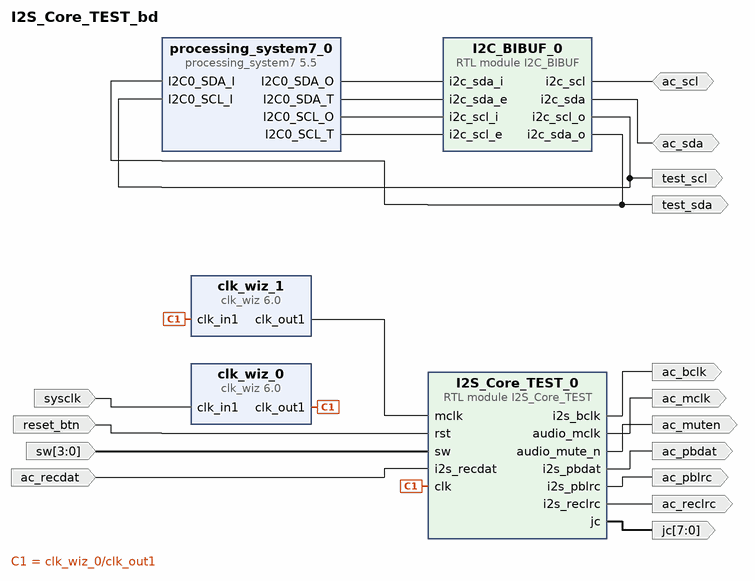
[diagram p0: block diagram of the top level]
# Vivado block design I2S_Core_TEST_bd, xc7z010clg400-1, Vivado 2020.1
create_bd_design I2S_Core_TEST_bd

create_bd_port -dir O -type clk ac_bclk
create_bd_port -dir O -type clk ac_mclk
create_bd_port -dir O ac_muten
create_bd_port -dir O ac_pbdat
create_bd_port -dir O ac_pblrc
create_bd_port -dir O ac_reclrc
create_bd_port -dir I -type rst reset_btn
set_property -dict {CONFIG.POLARITY ACTIVE_HIGH} [get_bd_ports reset_btn]
create_bd_port -dir O -from 7 -to 0 jc
create_bd_port -dir I -from 3 -to 0 sw
create_bd_port -dir IO ac_sda
create_bd_port -dir IO ac_scl
create_bd_port -dir I -type clk sysclk
set_property -dict {CONFIG.FREQ_HZ 125000000} [get_bd_ports sysclk]
create_bd_port -dir O test_scl
create_bd_port -dir O test_sda
create_bd_port -dir I ac_recdat

create_bd_cell -type ip -vlnv xilinx.com:ip:clk_wiz:6.0 clk_wiz_0
set_property -dict [list \
  CONFIG.CLKOUT1_DRIVES BUFG \
  CONFIG.CLKOUT1_JITTER 237.312 \
  CONFIG.CLKOUT1_PHASE_ERROR 249.865 \
  CONFIG.CLKOUT2_DRIVES BUFG \
  CONFIG.CLKOUT3_DRIVES BUFG \
  CONFIG.CLKOUT4_DRIVES BUFG \
  CONFIG.CLKOUT5_DRIVES BUFG \
  CONFIG.CLKOUT6_DRIVES BUFG \
  CONFIG.CLKOUT7_DRIVES BUFG \
  CONFIG.MMCM_BANDWIDTH OPTIMIZED \
  CONFIG.MMCM_CLKFBOUT_MULT_F 36 \
  CONFIG.MMCM_CLKOUT0_DIVIDE_F 9 \
  CONFIG.MMCM_COMPENSATION ZHOLD \
  CONFIG.PRIMITIVE PLL \
] [get_bd_cells clk_wiz_0]
create_bd_cell -type ip -vlnv xilinx.com:ip:clk_wiz:6.0 clk_wiz_1
set_property -dict [list \
  CONFIG.CLKOUT1_JITTER 360.948 \
  CONFIG.CLKOUT1_PHASE_ERROR 301.601 \
  CONFIG.CLKOUT1_REQUESTED_OUT_FREQ 12.288 \
  CONFIG.MMCM_CLKFBOUT_MULT_F 48.000 \
  CONFIG.MMCM_CLKOUT0_DIVIDE_F 78.125 \
  CONFIG.MMCM_DIVCLK_DIVIDE 5 \
] [get_bd_cells clk_wiz_1]
create_bd_cell -type module -reference I2C_BIBUF I2C_BIBUF_0
create_bd_cell -type ip -vlnv xilinx.com:ip:processing_system7:5.5 processing_system7_0
set_property -dict [list \
  CONFIG.PCW_EN_CLK0_PORT 0 \
  CONFIG.PCW_I2C0_I2C0_IO EMIO \
  CONFIG.PCW_I2C0_PERIPHERAL_ENABLE 1 \
  CONFIG.PCW_I2C_PERIPHERAL_FREQMHZ 111.111115 \
  CONFIG.PCW_UIPARAM_DDR_ENABLE 0 \
  CONFIG.PCW_USE_M_AXI_GP0 0 \
] [get_bd_cells processing_system7_0]
# 31 more settings of processing_system7_0 are not shown: defaults, MIO pin electricals, DDR timing, and values the tool derives
create_bd_cell -type module -reference I2S_Core_TEST I2S_Core_TEST_0

# ---- connections ----

connect_bd_net [get_bd_pins I2S_Core_TEST_0/i2s_bclk] [get_bd_ports ac_bclk]
connect_bd_net [get_bd_pins I2S_Core_TEST_0/audio_mclk] [get_bd_ports ac_mclk]
connect_bd_net -net I2S_Core_TEST_0_audio_mute [get_bd_pins I2S_Core_TEST_0/audio_mute_n] [get_bd_ports ac_muten]
connect_bd_net [get_bd_pins I2S_Core_TEST_0/i2s_pbdat] [get_bd_ports ac_pbdat]
connect_bd_net [get_bd_pins I2S_Core_TEST_0/i2s_pblrc] [get_bd_ports ac_pblrc]
connect_bd_net [get_bd_pins I2S_Core_TEST_0/i2s_reclrc] [get_bd_ports ac_reclrc]
connect_bd_net [get_bd_ports reset_btn] [get_bd_pins I2S_Core_TEST_0/rst]
connect_bd_net [get_bd_pins I2S_Core_TEST_0/jc] [get_bd_ports jc]
connect_bd_net [get_bd_ports sw] [get_bd_pins I2S_Core_TEST_0/sw]
connect_bd_net [get_bd_ports sysclk] [get_bd_pins clk_wiz_0/clk_in1]
connect_bd_net [get_bd_pins clk_wiz_0/clk_out1] [get_bd_pins clk_wiz_1/clk_in1] [get_bd_pins I2S_Core_TEST_0/clk]
connect_bd_net [get_bd_pins clk_wiz_1/clk_out1] [get_bd_pins I2S_Core_TEST_0/mclk]
connect_bd_net [get_bd_ports ac_sda] [get_bd_pins I2C_BIBUF_0/i2c_sda]
connect_bd_net [get_bd_ports ac_scl] [get_bd_pins I2C_BIBUF_0/i2c_scl]
connect_bd_net [get_bd_pins I2C_BIBUF_0/i2c_sda_o] [get_bd_ports test_sda] [get_bd_pins processing_system7_0/I2C0_SDA_I]
connect_bd_net [get_bd_pins I2C_BIBUF_0/i2c_scl_o] [get_bd_ports test_scl] [get_bd_pins processing_system7_0/I2C0_SCL_I]
connect_bd_net [get_bd_pins processing_system7_0/I2C0_SDA_O] [get_bd_pins I2C_BIBUF_0/i2c_sda_i]
connect_bd_net [get_bd_pins processing_system7_0/I2C0_SDA_T] [get_bd_pins I2C_BIBUF_0/i2c_sda_e]
connect_bd_net [get_bd_pins processing_system7_0/I2C0_SCL_O] [get_bd_pins I2C_BIBUF_0/i2c_scl_i]
connect_bd_net [get_bd_pins processing_system7_0/I2C0_SCL_T] [get_bd_pins I2C_BIBUF_0/i2c_scl_e]
connect_bd_net [get_bd_ports ac_recdat] [get_bd_pins I2S_Core_TEST_0/i2s_recdat]

validate_bd_design
save_bd_design
